# Altium schematic sheet 105358-3SC001-03_BlockDiagram.SchDoc: Block Diagram
size 420 x 297 mm; DrawnBy: JeSa , KaKa; Organization: Hotswap Norden AB; Address1: Knarrarnäsgatan 7; Address2: SE-164 40 Kista; Address3: Sweden; DocumentNumber: 105358-3SC001-03; SheetNumber: 2; SheetTotal: 5; PageSetup: Record=PageOptions|CenterHorizontal=True|CenterVertical=True|PrintScale=0.96|XCorrection=1.00|YCorrection=1.00|PrintKind=0|BorderSize=5000000|LeftOffset=0|BottomOffset=0|Orientation=2|PaperLength=1000|PaperWidth=1000|Scale=100|PaperSource=7|PrintQuality=-4|MediaType=1|DitherType=10|PaperKind=A3|PrintScaleMode=1
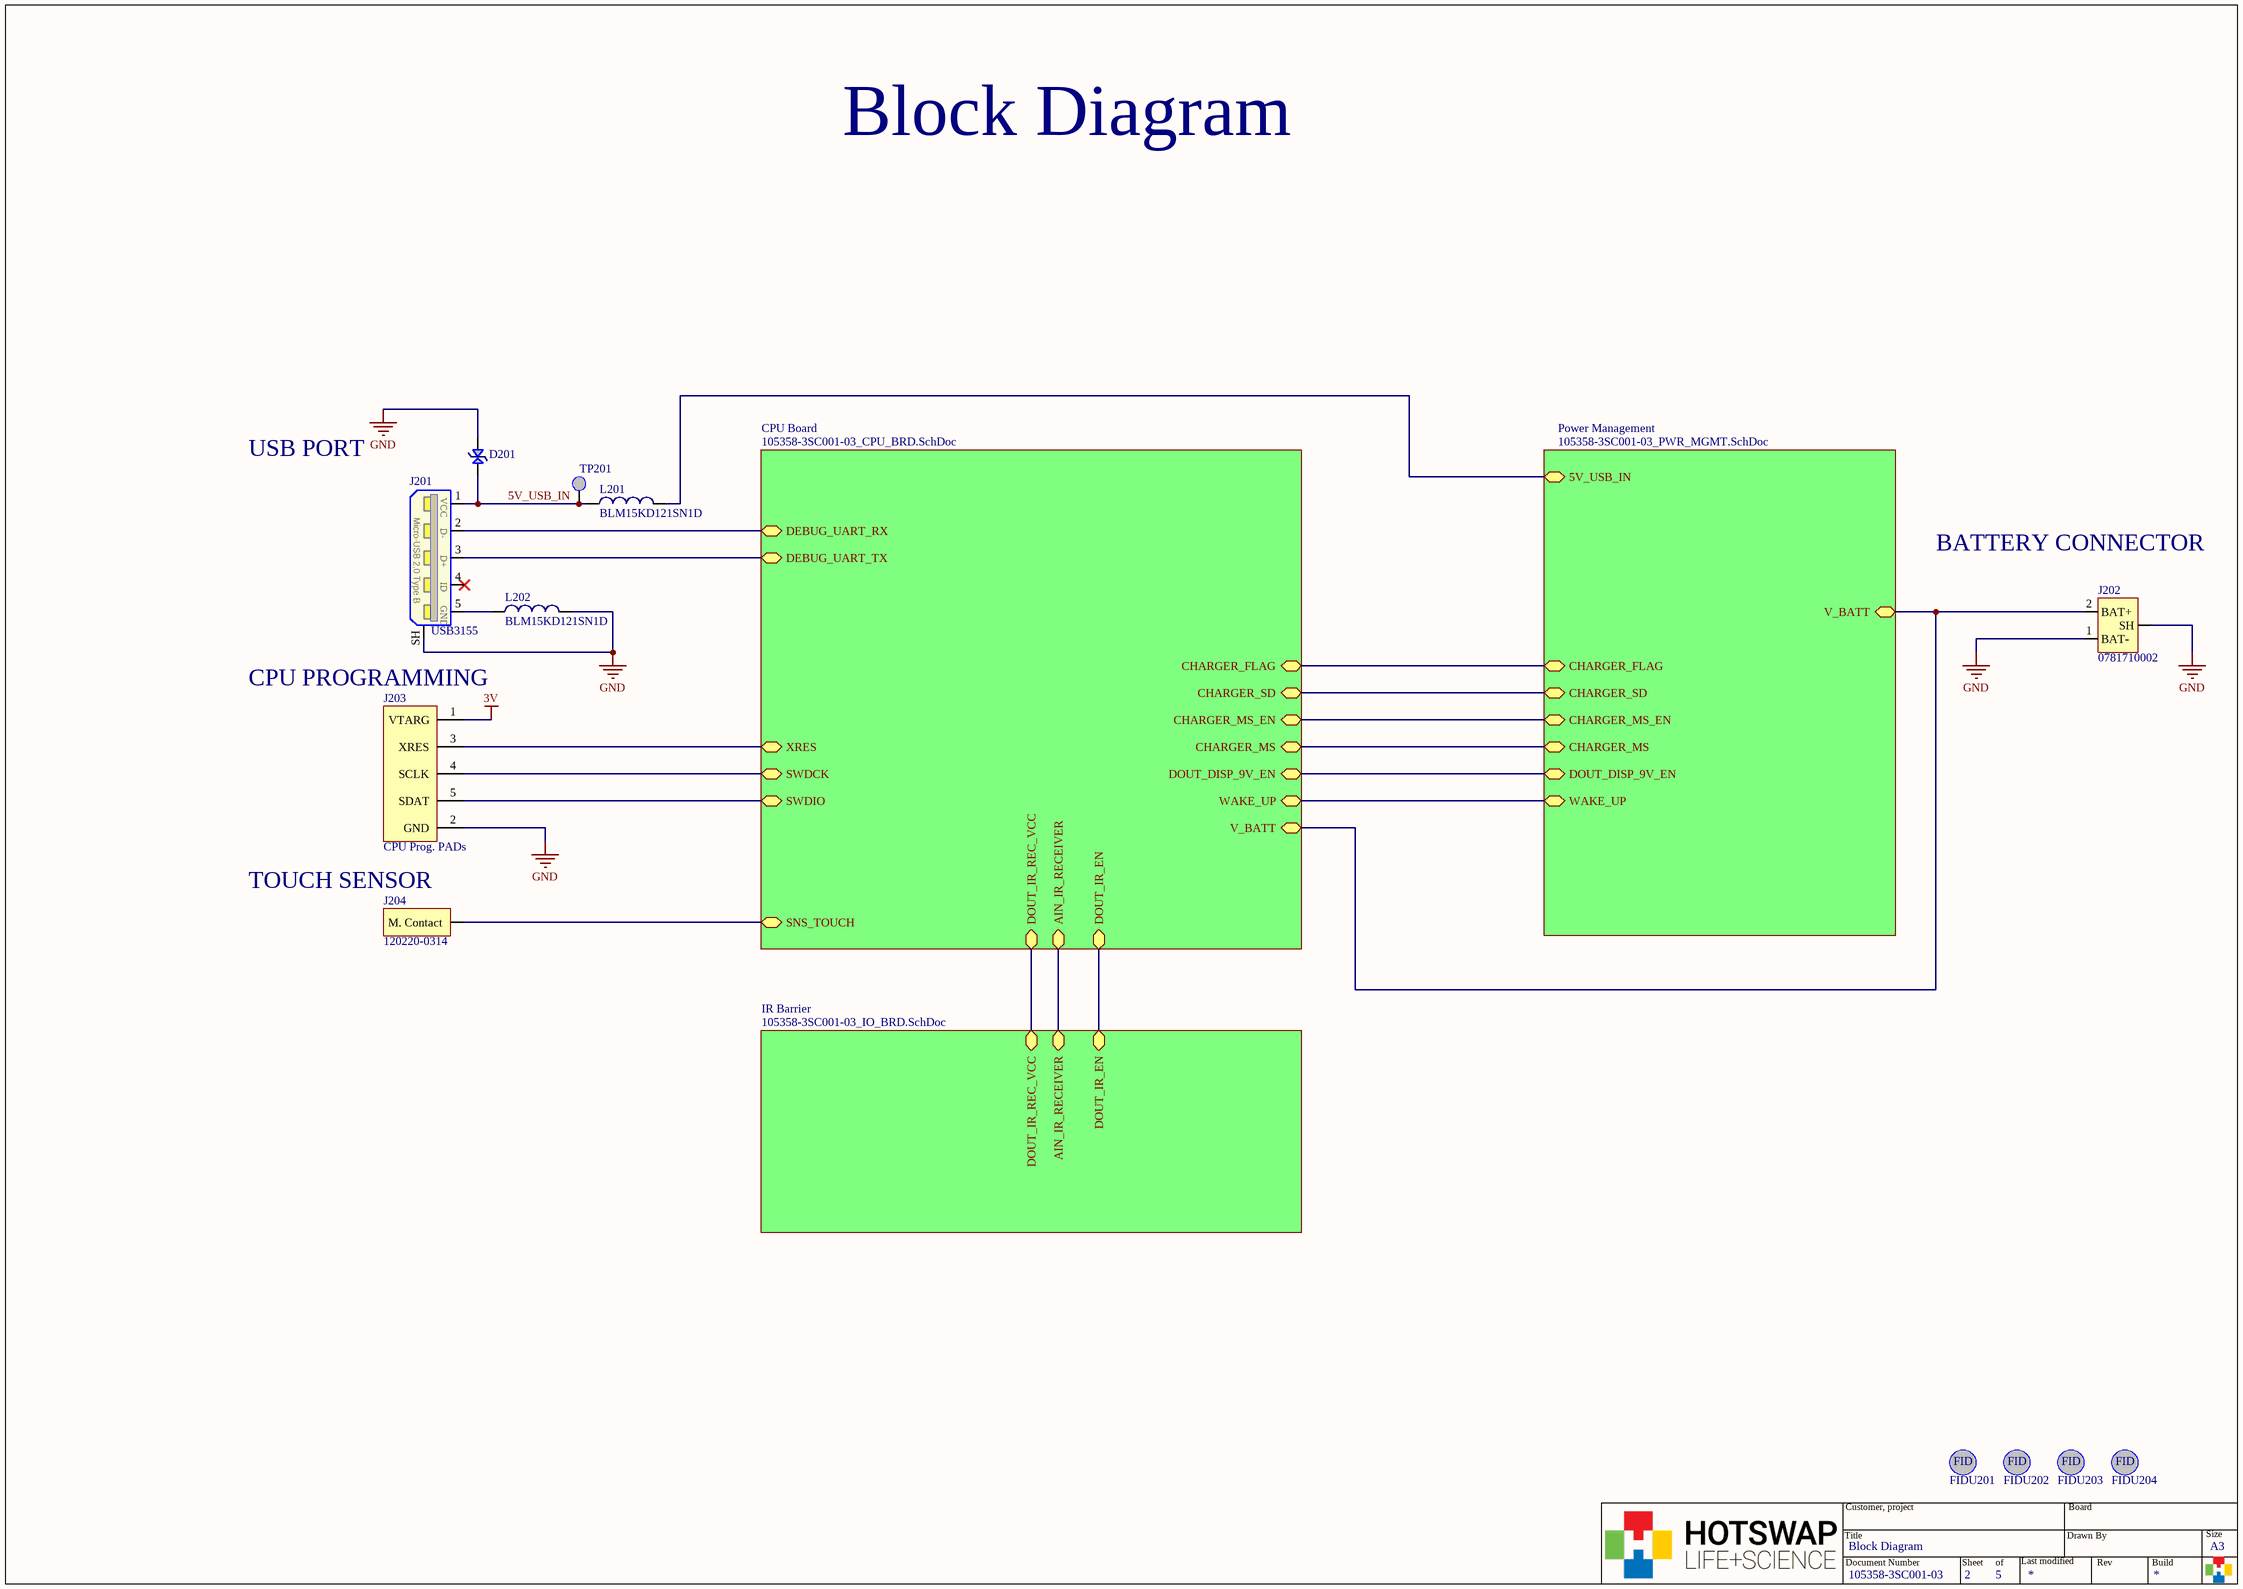
[diagram p0: 105358-3SC001-03_BlockDiagram.SchDoc]

## Parts
D201  LXES15AAA1-133  [0402C-GENERIC]  (value not drawn)
FIDU201  FIDU-miniROUND  [FIDU-MINI-ROUND]  (value not drawn)  (no BOM)
FIDU202  FIDU-miniROUND  [FIDU-MINI-ROUND]  (value not drawn)  (no BOM)
FIDU203  FIDU-miniROUND  [FIDU-MINI-ROUND]  (value not drawn)  (no BOM)
FIDU204  FIDU-miniROUND  [FIDU-MINI-ROUND]  (value not drawn)  (no BOM)
J201  USB3155  [USB3155]
J202  0781710002  [PAD 0781710002]
J203  CPU Prog. PADs  [PAD PROGRAMMING]  (no BOM)
J204  120220-0314  [PAD 1.0x1.95mm-MOD]
L201  BLM15KD121SN1D  [0402L_High Speed]
L202  BLM15KD121SN1D  [0402L_High Speed]
TP201  TEST POINT  [PAD TEST POINT]  (value not drawn)  (no BOM)

## Sub-sheets
CPU Board = 105358-3SC001-03_CPU_BRD.SchDoc: DEBUG_UART_TX, CHARGER_FLAG, DEBUG_UART_RX, CHARGER_MS, CHARGER_SD, CHARGER_MS_EN, WAKE_UP, DOUT_DISP_9V_EN, XRES, SWDCK, SWDIO, AIN_IR_RECEIVER, SNS_TOUCH, DOUT_IR_REC_VCC, DOUT_IR_EN, V_BATT
IR Barrier = 105358-3SC001-03_IO_BRD.SchDoc: AIN_IR_RECEIVER, DOUT_IR_REC_VCC, DOUT_IR_EN
Power Management = 105358-3SC001-03_PWR_MGMT.SchDoc: CHARGER_FLAG, CHARGER_MS_EN, CHARGER_SD, CHARGER_MS, WAKE_UP, DOUT_DISP_9V_EN, 5V_USB_IN, V_BATT

## Nets
3V: J203.1(VTARG)
GND: D201.1 J201.SH(Shell) J202.1(BAT-) J202.3(SH) J203.2(GND) L202.2
5V_USB_IN: D201.2 J201.1(VCC) L201.1 TP201.1(Test_Point)
NetJ201_2: J201.2(D-) ; sheet CPU Board/DEBUG_UART_RX
NetJ201_3: J201.3(D+) ; sheet CPU Board/DEBUG_UART_TX
NetJ201_5: J201.5(GND) L202.1
NetJ202_2: J202.2(BAT+) ; sheet Power Management/V_BATT, sheet CPU Board/V_BATT
NetJ203_3: J203.3(XRES) ; sheet CPU Board/XRES
NetJ203_4: J203.4(SCLK) ; sheet CPU Board/SWDCK
NetJ203_5: J203.5(SDAT) ; sheet CPU Board/SWDIO
NetJ204_1: J204.1(M._Contact) ; sheet CPU Board/SNS_TOUCH
NetL201_2: L201.2 ; sheet Power Management/5V_USB_IN
(unnamed): sheet Power Management/CHARGER_FLAG, sheet CPU Board/CHARGER_FLAG
(unnamed): sheet Power Management/CHARGER_MS_EN, sheet CPU Board/CHARGER_MS_EN
(unnamed): sheet Power Management/CHARGER_SD, sheet CPU Board/CHARGER_SD
(unnamed): sheet Power Management/CHARGER_MS, sheet CPU Board/CHARGER_MS
(unnamed): sheet Power Management/WAKE_UP, sheet CPU Board/WAKE_UP
(unnamed): sheet Power Management/DOUT_DISP_9V_EN, sheet CPU Board/DOUT_DISP_9V_EN
(unnamed): sheet CPU Board/AIN_IR_RECEIVER, sheet IR Barrier/AIN_IR_RECEIVER
(unnamed): sheet CPU Board/DOUT_IR_REC_VCC, sheet IR Barrier/DOUT_IR_REC_VCC
(unnamed): sheet CPU Board/DOUT_IR_EN, sheet IR Barrier/DOUT_IR_EN

Not connected (* = marked no-connect by the designer): J201 4(ID)*

## Notes on the sheet
- Block Diagram
- USB PORT
- BATTERY CONNECTOR
- CPU PROGRAMMING
- TOUCH SENSOR
- Title
- Customer, project
- Drawn By
- Board
- Size
- Document Number
- Sheet
- of
- Last modified
- Rev
- Build
- A3
- (in symbol FIDU-miniROUND) FID
- (in symbol USB3155) Micro-USB 2.0 Type B

## Library data of the parts
D201 = TVS DIODE 15VWM 0402: Manufacturer: Murata Electronics North America; Type: Zener; Capacitance @ Frequency: 0.05pF @ 1MHz; Voltage - Reverse Standoff (Typ): 15V; Manufacturer Part Number: LXES15AAA1-133; Digi-Key Part Number: 490-13209-1-ND; PackageReference: 0402
J201 = USB3155: CONN RCPT USB-mini B 2.0 5POS SLD; Manufacturer: GCT (GLOBAL CONNECTOR TECHNOLOGY); Manufacturer Part Number: USB3155-30-A; Connector Type: USB - micro B; ComponentLink1Description: Datasheet; ComponentLink1URL: https://gct.co/files/drawings/usb3155.pdf; Digi-Key Part Number: 2537026-Farnell; ClassName: 3D_EXPORT; ComponentLink2Description: Product Specification; ComponentLink2URL: https://gct.co/files/specs/usb3155-spec.pdf
J202 = CONNECTOR 1.20MM WTB HEADER VERT 2POS: 1.20MM WTB HEADER VERT 2POS; Manufacturer: Molex, LLC; ComponentLink1URL: http://www.molex.com/pdm_docs/sd/781710002_sd.pdf; ComponentLink1Description: Datasheet; Manufacturer Part Number: 0781710002; Mounting Type: Surface Mount; Digi-Key Part Number: WM4459CT-ND; ClassName: 3D_EXPORT
J203 = PROGRAMMING PADS: CPU Programming PADs; ClassName: TP
J204 = UNIVERSAL_CONTACT_3.5MM SMD: MICRO UNIVERSAL CONTACT Z 3.5MM; Manufacturer: ITT Cannon, LLC; ComponentLink1URL: https://media.digikey.com/pdf/Data%20Sheets/ITT%20PDFs/Universal%20Contact%20Z%20Series.pdf; ComponentLink1Description: DWG; Manufacturer Part Number: 120220-0314; Mounting Type: Surface Mount; Digi-Key Part Number: 1003-2383-2-ND; ClassName: 3D_EXPORT; ComponentLink2Description: Datasheet
L201 L202 = 0402L_FERRITE BEAD: FERRITE BEAD 120 OHM 0402 1LN; Manufacturer: Murata Electronics North America; Number of Lines: 1; Current Rating (Max): 1.5A; Impedance @ Frequency: 120 Ohm @ 100MHz; DC Resistance (DCR) (Max): 70 mOhm; Filter Type: Signal Line; Digi-Key Part Number: 490-15015-1-ND; Manufacturer Part Number: BLM15KD121SN1D; ComponentLink1Description: Datasheet; ComponentLink1URL: http://www.murata.com/en-us/products/productdata/8796740059166/ENFA0018.pdf; PackageReference: 0402 (1005 Metric)
TP201 = TEST POINT: Testing Poiny; ClassName: TP
FIDU201-FIDU204 = FIDU-miniROUND: ClassName: FIDU